# Altium schematic sheet RJ45.SchDoc
size C
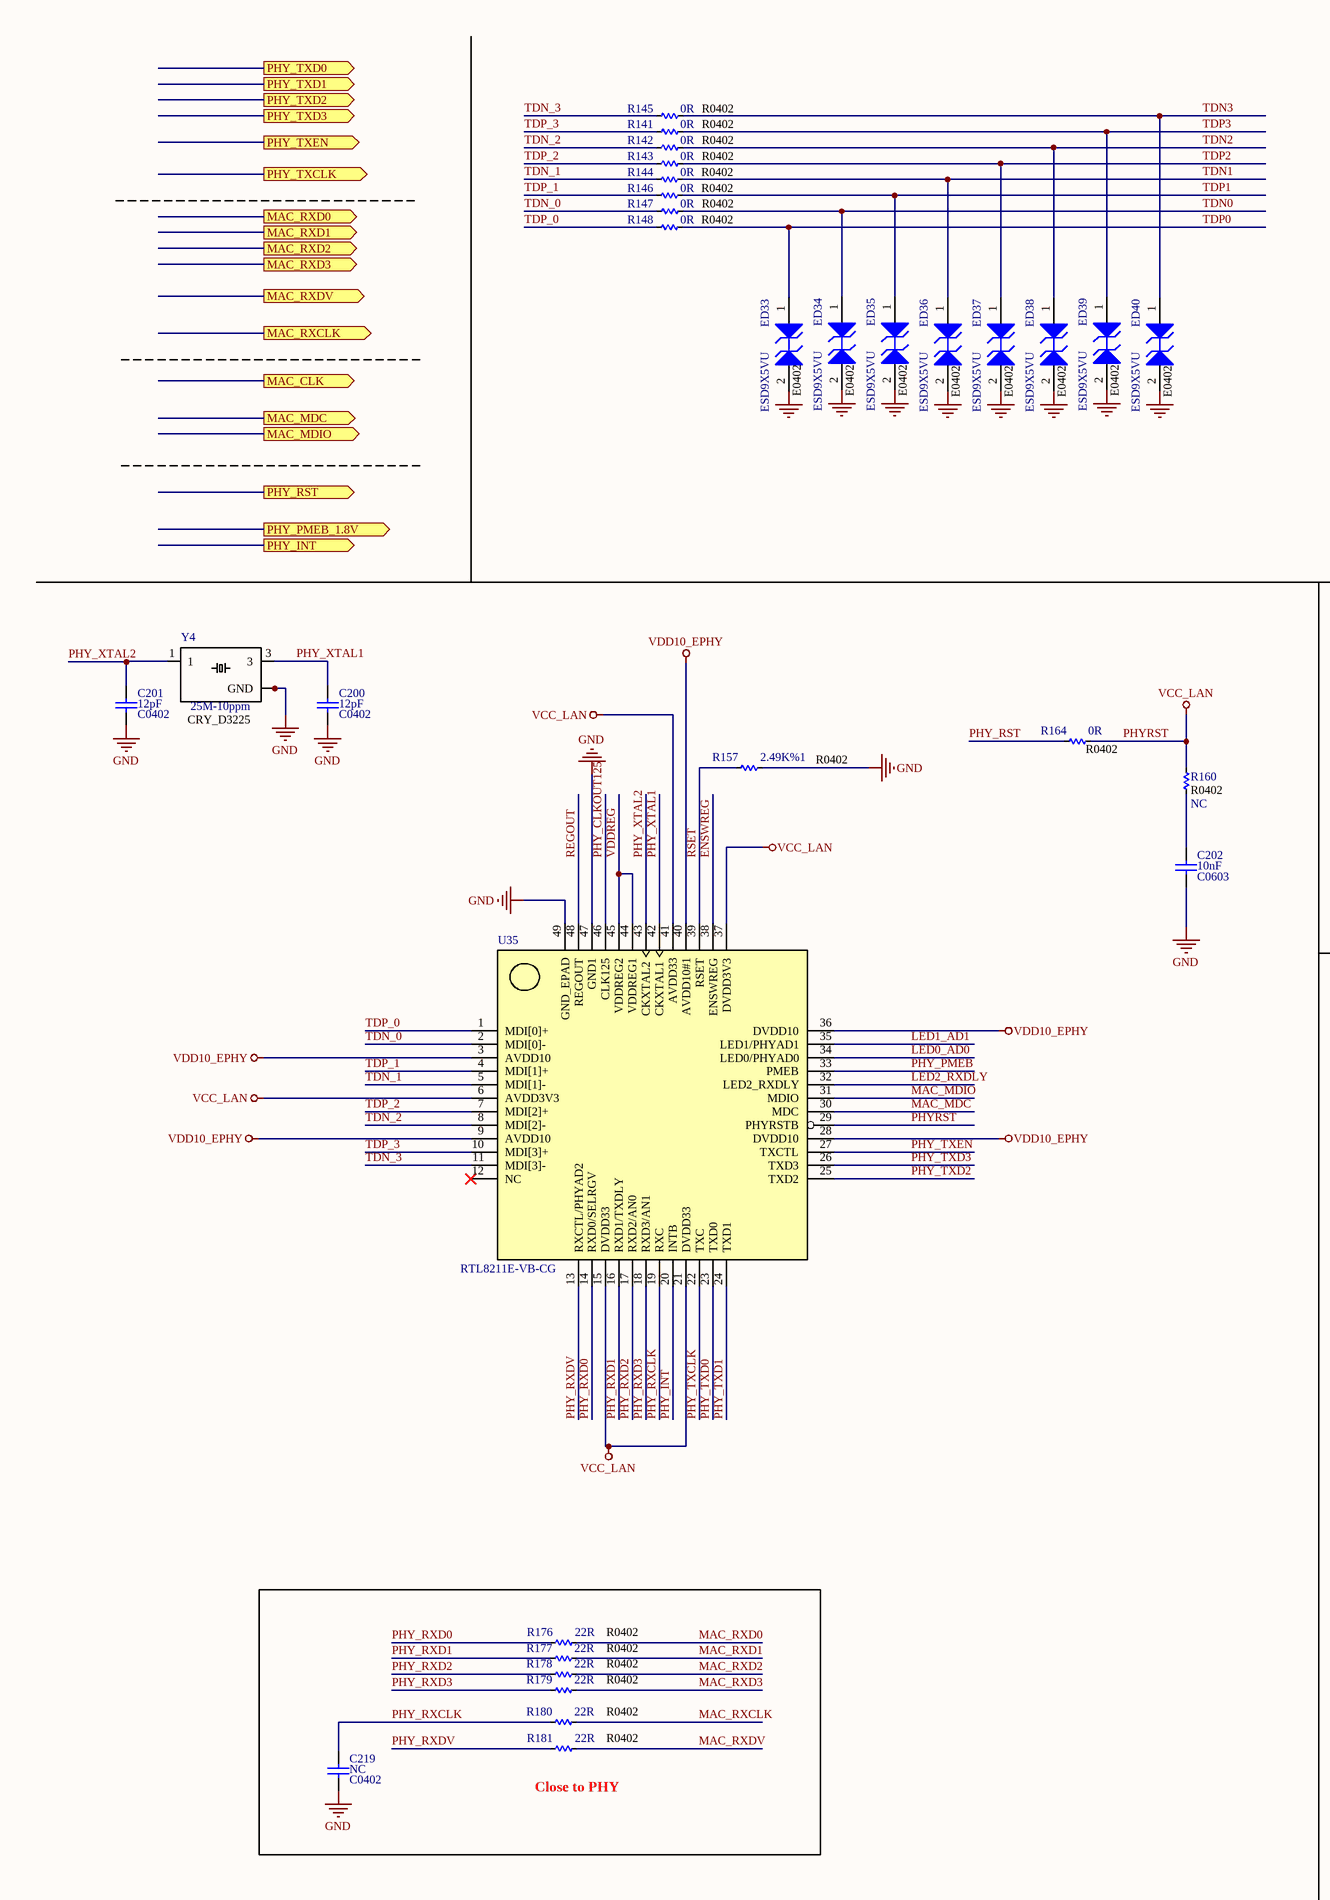
[diagram p0: RJ45.SchDoc, left]
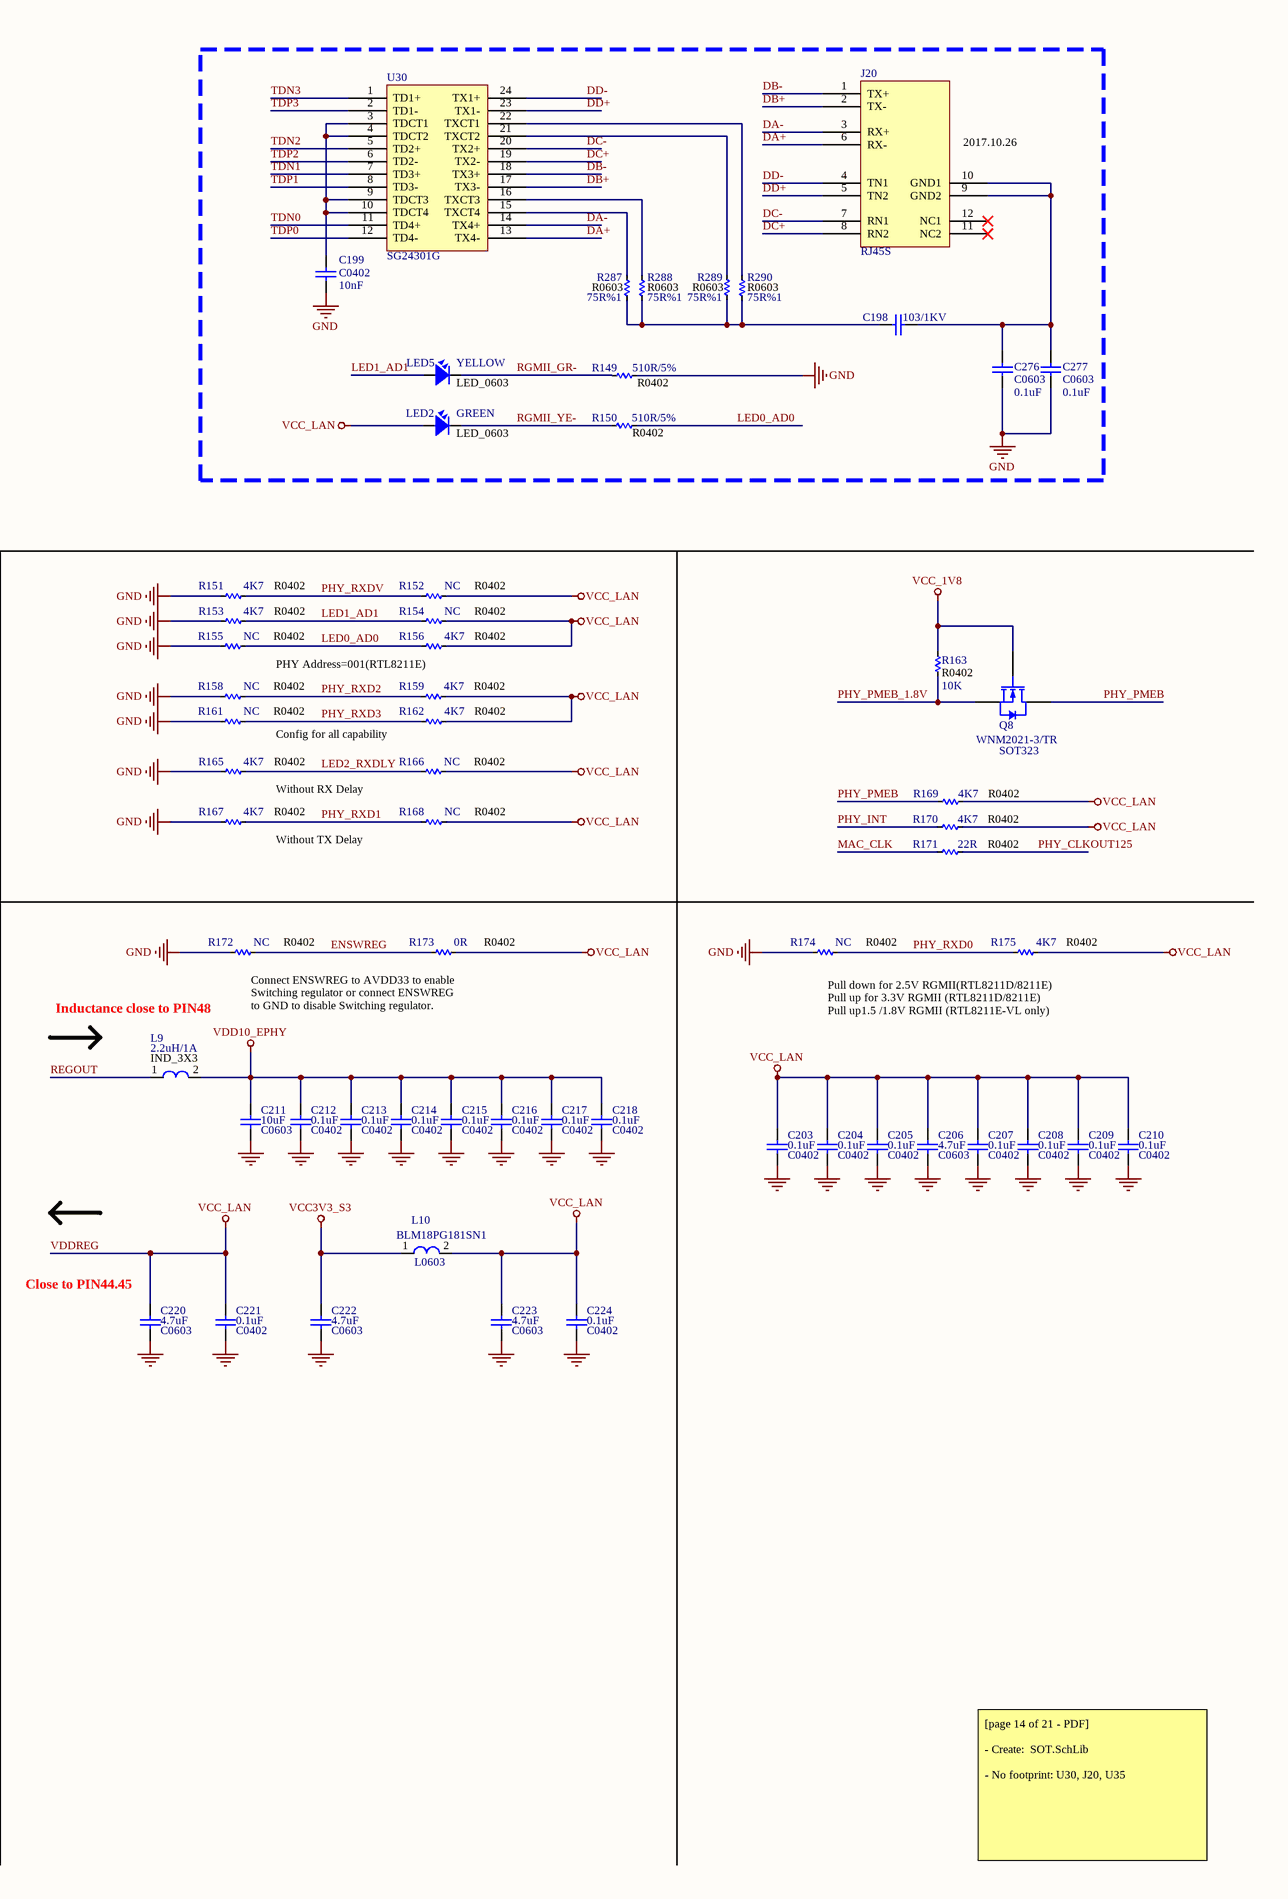
[diagram p1: RJ45.SchDoc, right]

## Parts
C198  value 103/1KV  [C 1206]  (hidden comment: C1206)
C199  C0402  value 10nF  [C 0402]
C200  C0402  value 12pF  [C 0402]
C201  C0402  value 12pF  [C 0402]
C202  C0603  value 10nF  [C 0603]
C203  C0402  value 0.1uF  [C 0402]
C204  C0402  value 0.1uF  [C 0402]
C205  C0402  value 0.1uF  [C 0402]
C206  C0603  value 4.7uF  [C 0603]
C207  C0402  value 0.1uF  [C 0402]
C208  C0402  value 0.1uF  [C 0402]
C209  C0402  value 0.1uF  [C 0402]
C210  C0402  value 0.1uF  [C 0402]
C211  C0603  value 10uF  [C 0603]
C212  C0402  value 0.1uF  [C 0402]
C213  C0402  value 0.1uF  [C 0402]
C214  C0402  value 0.1uF  [C 0402]
C215  C0402  value 0.1uF  [C 0402]
C216  C0402  value 0.1uF  [C 0402]
C217  C0402  value 0.1uF  [C 0402]
C218  C0402  value 0.1uF  [C 0402]
C219  C0402  value NC  [C 0402]
C220  C0603  value 4.7uF  [C 0603]
C221  C0402  value 0.1uF  [C 0402]
C222  C0603  value 4.7uF  [C 0603]
C223  C0603  value 4.7uF  [C 0603]
C224  C0402  value 0.1uF  [C 0402]
C276  C0603  value 0.1uF  [C 0603]
C277  C0603  value 0.1uF  [C 0603]
ED33  ESD9X5VU  size: E0402  [DFN1006-2L]
ED34  ESD9X5VU  size: E0402  [DFN1006-2L]
ED35  ESD9X5VU  size: E0402  [DFN1006-2L]
ED36  ESD9X5VU  size: E0402  [DFN1006-2L]
ED37  ESD9X5VU  size: E0402  [DFN1006-2L]
ED38  ESD9X5VU  size: E0402  [DFN1006-2L]
ED39  ESD9X5VU  size: E0402  [DFN1006-2L]
ED40  ESD9X5VU  size: E0402  [DFN1006-2L]
J20  RJ45S  [RJ45]
L9  2.2uH/1A  [L-SMD-M-7.3x4.5]
L10  L0603  [L-SMD-M-12x10]
LED2  Package: LED_0603  Color: GREEN  [SM-LED-0805-Green]  (hidden comment: LED SMD)
LED5  Package: LED_0603  Color: YELLOW  [SM-LED-0805-Yellow]  (hidden comment: LED SMD)
Q8  WNM2021-3/TR  PackageReference: SOT323  [SOT23]
R141  R0402  value 0R  [R 0402]
R142  R0402  value 0R  [R 0402]
R143  R0402  value 0R  [R 0402]
R144  R0402  value 0R  [R 0402]
R145  R0402  value 0R  [R 0402]
R146  R0402  value 0R  [R 0402]
R147  R0402  value 0R  [R 0402]
R148  R0402  value 0R  [R 0402]
R149  R0402  value 510R/5%  [R 0402]
R150  R0402  value 510R/5%  [R 0402]
R151  R0402  value 4K7  [R 0402]
R152  R0402  value NC  [R 0402]
R153  R0402  value 4K7  [R 0402]
R154  R0402  value NC  [R 0402]
R155  R0402  value NC  [R 0402]
R156  R0402  value 4K7  [R 0402]
R157  R0402  value 2.49K%1  [R 0402]
R158  R0402  value NC  [R 0402]
R159  R0402  value 4K7  [R 0402]
R160  R0402  value NC  [R 0402]
R161  R0402  value NC  [R 0402]
R162  R0402  value 4K7  [R 0402]
R163  R0402  value 10K  [R 0402]
R164  R0402  value 0R  [R 0402]
R165  R0402  value 4K7  [R 0402]
R166  R0402  value NC  [R 0402]
R167  R0402  value 4K7  [R 0402]
R168  R0402  value NC  [R 0402]
R169  R0402  value 4K7  [R 0402]
R170  R0402  value 4K7  [R 0402]
R171  R0402  value 22R  [R 0402]
R172  R0402  value NC  [R 0402]
R173  R0402  value 0R  [R 0402]
R174  R0402  value NC  [R 0402]
R175  R0402  value 4K7  [R 0402]
R176  R0402  value 22R  [R 0402]
R177  R0402  value 22R  [R 0402]
R178  R0402  value 22R  [R 0402]
R179  R0402  value 22R  [R 0402]
R180  R0402  value 22R  [R 0402]
R181  R0402  value 22R  [R 0402]
R287  R0603  value 75R%1  [R 0603]
R288  R0603  value 75R%1  [R 0603]
R289  R0603  value 75R%1  [R 0603]
R290  R0603  value 75R%1  [R 0603]
U30  SG24301G  [SG24301G]
U35  RTL8211E-VB-CG  [QFN48]
Y4  25M-10ppm  [Crystal 4-SMD 32x25]

## Blocks framed on the sheet
Close to PHY: C219 R176-R181

## Ports
MAC_CLK (out), MAC_MDC (out), MAC_MDIO (out), MAC_RXCLK (out), MAC_RXD0 (out), MAC_RXD1 (out), MAC_RXD2 (out), MAC_RXD3 (out), MAC_RXDV (out), PHY_INT (out), PHY_PMEB_1.8V (out), PHY_RST (out), PHY_TXCLK (out), PHY_TXD0 (out), PHY_TXD1 (out), PHY_TXD2 (out), PHY_TXD3 (out), PHY_TXEN (out)

## Nets
GND: C199.1 C200.2 C201.2 C202.2 C203.2 C204.2 C205.2 C206.2 C207.2 C208.2 C209.2 C210.2 C211.2 C212.2 C213.2 C214.2 C215.2 C216.2 C217.2 C218.2 C219.2 C220.2 C221.2 C222.2 C223.2 C224.2 C276.2 C277.2 ED33.2(A2) ED34.2(A2) ED35.2(A2) ED36.2(A2) ED37.2(A2) ED38.2(A2) ED39.2(A2) ED40.2(A2) R149.1 R151.1 R153.1 R155.1 R157.2 R158.1 R161.1 R165.1 R167.1 R172.1 R174.1 U35.47(GND1) U35.49(GND_EPAD) Y4.2(GND) Y4.4(GND)
PHYRST: C203.1 C204.1 C205.1 C206.1 C207.1 C208.1 C209.1 C210.1 C220.1 C221.1 C223.1 C224.1 L10.2 LED2.1 R152.2 R154.2 R156.2 R159.2 R160.2 R162.2 R164.2 R166.2 R168.2 R169.2 R170.2 R173.2 R175.2 U35.6(AVDD3V3) U35.15(DVDD33) U35.21(DVDD33) U35.29(PHYRSTB) U35.37(DVDD3V3) U35.41(AVDD33) U35.44(VDDREG1) U35.45(VDDREG2)  [also labelled VCC_LAN, VDDREG]
VCC3V3_S3: C222.1 L10.1
VCC_1V8: Q8.3(G) R163.1
VDD10_EPHY: C211.1 C212.1 C213.1 C214.1 C215.1 C216.1 C217.1 C218.1 L9.2 U35.3(AVDD10) U35.9(AVDD10) U35.28(DVDD10) U35.36(DVDD10) U35.40(AVDD10#1)
DA+: J20.6(RX-) U30.13(TX4-)
DA-: J20.3(RX+) U30.14(TX4+)
DB+: J20.2(TX-) U30.17(TX3-)
DB-: J20.1(TX+) U30.18(TX3+)
DC+: J20.8(RN2) U30.19(TX2-)
DC-: J20.7(RN1) U30.20(TX2+)
DD+: J20.5(TN2) U30.23(TX1-)
DD-: J20.4(TN1) U30.24(TX1+)
ENSWREG: R172.2 R173.1 U35.38(ENSWREG)
LED0_AD0: R150.1 R155.2 R156.1 U35.34(LED0/PHYAD0)
LED1_AD1: LED5.1 R153.2 R154.1 U35.35(LED1/PHYAD1)
LED2_RXDLY: R165.2 R166.1 U35.32(LED2_RXDLY)
MAC_CLK: R171.1
MAC_MDC: U35.30(MDC)
MAC_MDIO: U35.31(MDIO)
MAC_RXCLK: R180.2
MAC_RXD0: R176.2
MAC_RXD1: R177.2
MAC_RXD2: R178.2
MAC_RXD3: R179.2
MAC_RXDV: R181.2
PHY_CLKOUT125: R171.2 U35.46(CLK125)
PHY_INT: R170.1 U35.20(INTB)
PHY_PMEB: Q8.1(D) R169.1 U35.33(PMEB)
PHY_PMEB_1.8V: Q8.2(S) R163.2
PHY_RST: R164.1
PHY_RXCLK: C219.1 R180.1 U35.19(RXC)
PHY_RXD0: R174.2 R175.1 R176.1 U35.14(RXD0/SELRGV)
PHY_RXD1: R167.2 R168.1 R177.1 U35.16(RXD1/TXDLY)
PHY_RXD2: R158.2 R159.1 R178.1 U35.17(RXD2/AN0)
PHY_RXD3: R161.2 R162.1 R179.1 U35.18(RXD3/AN1)
PHY_RXDV: R151.2 R152.1 R181.1 U35.13(RXCTL/PHYAD2)
PHY_TXCLK: U35.22(TXC)
PHY_TXD0: U35.23(TXD0)
PHY_TXD1: U35.24(TXD1)
PHY_TXD2: U35.25(TXD2)
PHY_TXD3: U35.26(TXD3)
PHY_TXEN: U35.27(TXCTL)
PHY_XTAL1: C200.1 U35.42(CKXTAL1) Y4.3
PHY_XTAL2: C201.1 U35.43(CKXTAL2) Y4.1
REGOUT: L9.1 U35.48(REGOUT)
RGMII_GR-: LED5.2 R149.2
RGMII_YE-: LED2.2 R150.2
RSET: R157.1 U35.39(RSET)
TDN0: ED34.1(A1) R147.2 U30.11(TD4+)
TDN1: ED36.1(A1) R144.2 U30.7(TD3+)
TDN2: ED38.1(A1) R142.2 U30.5(TD2+)
TDN3: ED40.1(A1) R145.2 U30.1(TD1+)
TDN_0: R147.1 U35.2(MDI[0]-)
TDN_1: R144.1 U35.5(MDI[1]-)
TDN_2: R142.1 U35.8(MDI[2]-)
TDN_3: R145.1 U35.11(MDI[3]-)
TDP0: ED33.1(A1) R148.2 U30.12(TD4-)
TDP1: ED35.1(A1) R146.2 U30.8(TD3-)
TDP2: ED37.1(A1) R143.2 U30.6(TD2-)
TDP3: ED39.1(A1) R141.2 U30.2(TD1-)
TDP_0: R148.1 U35.1(MDI[0]+)
TDP_1: R146.1 U35.4(MDI[1]+)
TDP_2: R143.1 U35.7(MDI[2]+)
TDP_3: R141.1 U35.10(MDI[3]+)
NetC198_1: C198.1 C276.1 C277.1 J20.9(GND2) J20.10(GND1)
NetC198_2: C198.2 R287.1 R288.1 R289.1 R290.1
NetC199_2: C199.2 U30.3(TDCT1) U30.4(TDCT2) U30.9(TDCT3) U30.10(TDCT4)
NetC202_1: C202.1 R160.1
NetR287_2: R287.2 U30.15(TXCT4)
NetR288_2: R288.2 U30.16(TXCT3)
NetR289_2: R289.2 U30.21(TXCT2)
NetR290_2: R290.2 U30.22(TXCT1)

Not connected (* = marked no-connect by the designer): J20 11(NC2)* 12(NC1)*; U35 12(NC)*

## Notes on the sheet
- (near J20) 2017.10.26
- (near R156) PHY Address=001(RTL8211E)
- (near R162) Config for all capability
- (near R166) Without RX Delay
- (near R168) Without TX Delay
- Inductance close to PIN48
- Connect ENSWREG to AVDD33 to enable Switching regulator or connect ENSWREG to GND to disable Switching regulator.
- Pull down for 2.5V RGMII(RTL8211D/8211E) Pull up for 3.3V RGMII (RTL8211D/8211E) Pull up1.5 /1.8V RGMII (RTL8211E-VL only)
- (near C220) Close to PIN44.45
- [page 14 of 21 - PDF]
  - Create:  SOT.SchLib
  - No footprint: U30, J20, U35
- (in symbol ABM8-30.000MHZ-10-1-U-T) CRY_D3225
- (in symbol L-SMD-1) IND_3X3; BLM18PG181SN1

## Library data of the parts
C198-C224 C276 C277 = Cap: Capacitor; Published: 8-Jun-2000; LatestRevisionDate: 17-Jul-2002; LatestRevisionNote: Re-released for DXP Platform.; PackageReference: RAD-0.3; Publisher: Altium Limited; PackageDescription: Radial Cap, Thru-Hole; 2 Leads; 0.3 in Pin Spacing
ED33-ED40 = 1SMB54CAT3: 600 W Peak Power Zener Transient Voltage Suppressor, Bidirectional, 2-Pin SMB, Tape and Reel; Manufacturer: On Semiconductor; IR Max (uA): 5; PPK Max (W): 600; V(BR) Typ (V): 63.16; DatasheetVersion: Rev. A; PackageVersion: Rev. A, 01/2000; PackageReference: SMB-2-403C-01; PackageDescription: 2-Pin Small Molded Package, J-Bend Lead, Body 4.315 x 3.555 mm; Supplier 1: Digi-Key; Supplier Part Number 1: 1SMB54CAT3-ND; Direction: Bidirectional; Packing: Tape and Reel; Mounting Technology: Surface Mount; PartNumber: 1SMB54CAT3; ComponentLink1Description: Manufacturer URL; ComponentLink1URL: http://www.onsemi.com/; ComponentLink2Description: Datasheet; ComponentLink2URL: http://www.onsemi.com/pub_link/Collateral/1SMB10CAT3-D.PDF; ComponentLink3Description: Package Specification; ComponentLink3URL: http://www.onsemi.com/pub_link/Collateral/1SMB10CAT3-D.PDF
L9 L10 = L-SMD-1: partNo: 78477010; Manufacturer: Wurth Elektronik; Inductance: 1.0 μH; ComponentLink1Description: Manufacturer; ComponentLink1URL: http://www.we-online.de; Created by: Baojun Chen; Created Date: Nov.2015; ComponentLink2Description: Datasheet; ComponentLink2URL: http://katalog.we-online.de/pbs/datasheet/78477010.pdf
LED2 LED5 = LED-SMD-0805
Q8 = ZXM61N02F: 20V N-Channel Enhancement Mode MOSFET; Published: 17-Dec-2003; DatasheetVersion: May-99; PackageVersion: 1996; Publisher: Altium Limited; PackageDescription: SOT-23; 3 Leads; Body 3.1 x 2.5 mm, inc. leads (LxW max), Alternate Lead Configuration; ComponentLink1Description: Manufacturer Link; ComponentLink1URL: http://www.zetex.com/; ComponentLink2Description: Datasheet; ComponentLink2URL: www.zetex.com/3.0/pdf/ZXM61N02F.pdf
R141-R181 R287-R290 = Res-SMD: Resistor; Manufacturer: Generic Components; Class: Passive; Published: 08/06/2000; Publisher: Altium Hobart Technology Centre
Y4 = ABM8-30.000MHZ-10-1-U-T: Ultra Miniature Crystal, SMD Ceramic, 30.000MHZ, 10pF, 10ppm@25C, 10ppm -10+60C,; MF: Abracon; SnapEDA_Link: https://www.snapeda.com/parts/ABM8-30.000MHZ-10-1-U-T/Abracon%20LLC/view-part/?ref=snap; MP: ABM8-30.000MHZ-10-1-U-T; Availability: Unavailable; Price: None; Package: SMD-4 Abracon; Value: *